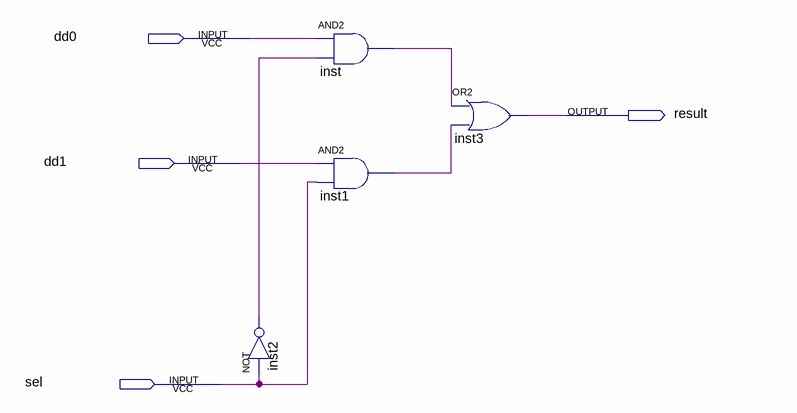
[diagram p0: schematic sheet]
// Quartus schematic mux2_1.bdf as structural Verilog: 4 symbols, 4 pins
module mux2_1 (
  input  dd0,
  input  dd1,
  input  sel,
  output result
);

  wire inst1_out, inst2_out, inst_out;

  not inst2 (inst2_out, sel);
  and inst (inst_out, dd0, inst2_out);
  and inst1 (inst1_out, dd1, sel);
  or inst3 (result, inst_out, inst1_out);
endmodule
